# Altium schematic sheet 06.MCU_PD.SchDoc
size 297 x 209 mm
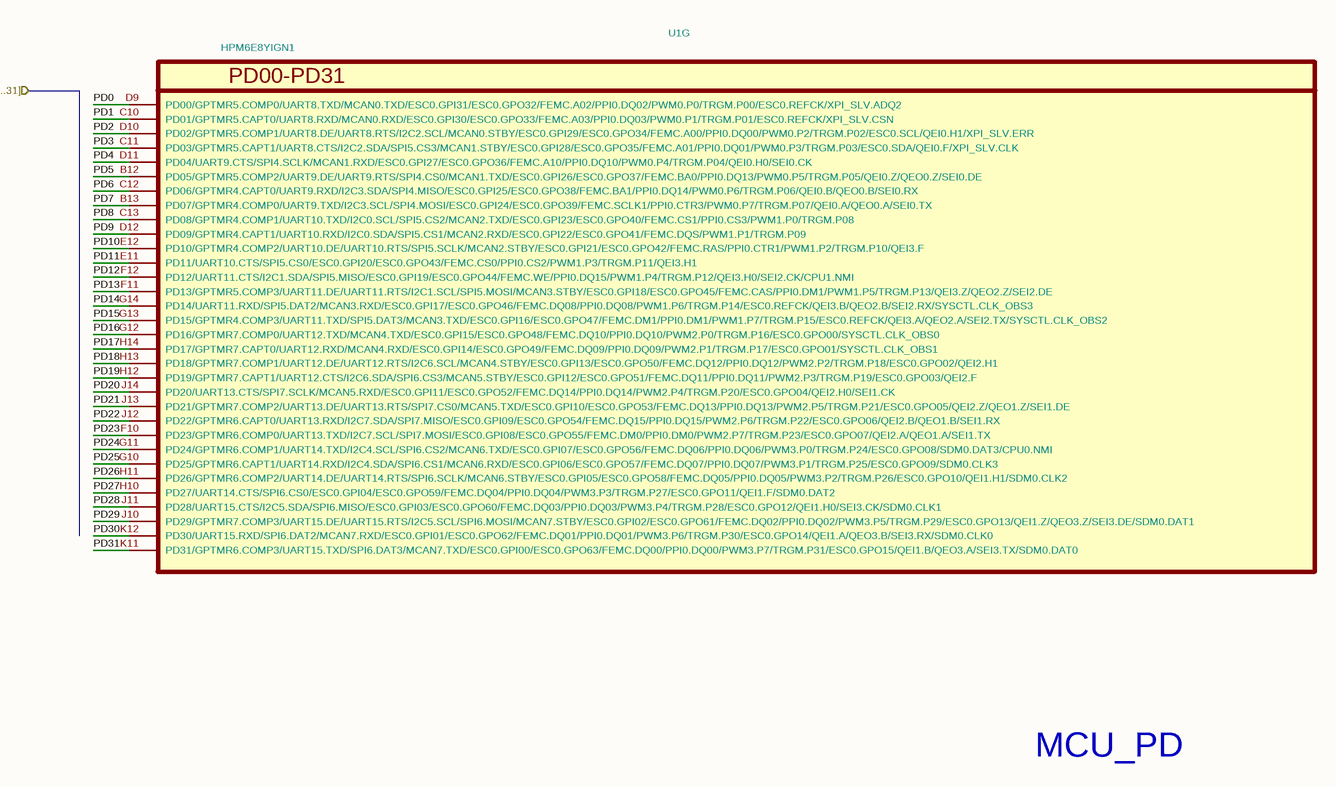
[diagram p0: 06.MCU_PD.SchDoc]

## Parts
U1  HPM6E8YIGN1  [BGA-196_14x14_12.0x12.0mm_P0.8mm]  (part G of 10)

## Ports
PD[0..31] (in)

## Nets
PD0: U1.D9(PD00/GPTMR5.COMP0/UART8.TXD/MCAN0.TXD/ESC0.GPI31/ESC0.GPO32/FEMC.A02/PPI0.DQ02/PWM0.P0/TRGM.P00/ESC0.REFCK/XPI_SLV.ADQ2)
PD1: U1.C10(PD01/GPTMR5.CAPT0/UART8.RXD/MCAN0.RXD/ESC0.GPI30/ESC0.GPO33/FEMC.A03/PPI0.DQ03/PWM0.P1/TRGM.P01/ESC0.REFCK/XPI_SLV.CSN)
PD2: U1.D10(PD02/GPTMR5.COMP1/UART8.DE/UART8.RTS/I2C2.SCL/MCAN0.STBY/ESC0.GPI29/ESC0.GPO34/FEMC.A00/PPI0.DQ00/PWM0.P2/TRGM.P02/ESC0.SCL/QEI0.H1/XPI_SLV.ERR)
PD3: U1.C11(PD03/GPTMR5.CAPT1/UART8.CTS/I2C2.SDA/SPI5.CS3/MCAN1.STBY/ESC0.GPI28/ESC0.GPO35/FEMC.A01/PPI0.DQ01/PWM0.P3/TRGM.P03/ESC0.SDA/QEI0.F/XPI_SLV.CLK)
PD4: U1.D11(PD04/UART9.CTS/SPI4.SCLK/MCAN1.RXD/ESC0.GPI27/ESC0.GPO36/FEMC.A10/PPI0.DQ10/PWM0.P4/TRGM.P04/QEI0.H0/SEI0.CK)
PD5: U1.B12(PD05/GPTMR5.COMP2/UART9.DE/UART9.RTS/SPI4.CS0/MCAN1.TXD/ESC0.GPI26/ESC0.GPO37/FEMC.BA0/PPI0.DQ13/PWM0.P5/TRGM.P05/QEI0.Z/QEO0.Z/SEI0.DE)
PD6: U1.C12(PD06/GPTMR4.CAPT0/UART9.RXD/I2C3.SDA/SPI4.MISO/ESC0.GPI25/ESC0.GPO38/FEMC.BA1/PPI0.DQ14/PWM0.P6/TRGM.P06/QEI0.B/QEO0.B/SEI0.RX)
PD7: U1.B13(PD07/GPTMR4.COMP0/UART9.TXD/I2C3.SCL/SPI4.MOSI/ESC0.GPI24/ESC0.GPO39/FEMC.SCLK1/PPI0.CTR3/PWM0.P7/TRGM.P07/QEI0.A/QEO0.A/SEI0.TX)
PD8: U1.C13(PD08/GPTMR4.COMP1/UART10.TXD/I2C0.SCL/SPI5.CS2/MCAN2.TXD/ESC0.GPI23/ESC0.GPO40/FEMC.CS1/PPI0.CS3/PWM1.P0/TRGM.P08)
PD9: U1.D12(PD09/GPTMR4.CAPT1/UART10.RXD/I2C0.SDA/SPI5.CS1/MCAN2.RXD/ESC0.GPI22/ESC0.GPO41/FEMC.DQS/PWM1.P1/TRGM.P09)
PD10: U1.E12(PD10/GPTMR4.COMP2/UART10.DE/UART10.RTS/SPI5.SCLK/MCAN2.STBY/ESC0.GPI21/ESC0.GPO42/FEMC.RAS/PPI0.CTR1/PWM1.P2/TRGM.P10/QEI3.F)
PD11: U1.E11(PD11/UART10.CTS/SPI5.CS0/ESC0.GPI20/ESC0.GPO43/FEMC.CS0/PPI0.CS2/PWM1.P3/TRGM.P11/QEI3.H1)
PD12: U1.F12(PD12/UART11.CTS/I2C1.SDA/SPI5.MISO/ESC0.GPI19/ESC0.GPO44/FEMC.WE/PPI0.DQ15/PWM1.P4/TRGM.P12/QEI3.H0/SEI2.CK/CPU1.NMI)
PD13: U1.F11(PD13/GPTMR5.COMP3/UART11.DE/UART11.RTS/I2C1.SCL/SPI5.MOSI/MCAN3.STBY/ESC0.GPI18/ESC0.GPO45/FEMC.CAS/PPI0.DM1/PWM1.P5/TRGM.P13/QEI3.Z/QEO2.Z/SEI2.DE)
PD14: U1.G14(PD14/UART11.RXD/SPI5.DAT2/MCAN3.RXD/ESC0.GPI17/ESC0.GPO46/FEMC.DQ08/PPI0.DQ08/PWM1.P6/TRGM.P14/ESC0.REFCK/QEI3.B/QEO2.B/SEI2.RX/SYSCTL.CLK_OBS3)
PD15: U1.G13(PD15/GPTMR4.COMP3/UART11.TXD/SPI5.DAT3/MCAN3.TXD/ESC0.GPI16/ESC0.GPO47/FEMC.DM1/PPI0.DM1/PWM1.P7/TRGM.P15/ESC0.REFCK/QEI3.A/QEO2.A/SEI2.TX/SYSCTL.CLK_OBS2)
PD16: U1.G12(PD16/GPTMR7.COMP0/UART12.TXD/MCAN4.TXD/ESC0.GPI15/ESC0.GPO48/FEMC.DQ10/PPI0.DQ10/PWM2.P0/TRGM.P16/ESC0.GPO00/SYSCTL.CLK_OBS0)
PD17: U1.H14(PD17/GPTMR7.CAPT0/UART12.RXD/MCAN4.RXD/ESC0.GPI14/ESC0.GPO49/FEMC.DQ09/PPI0.DQ09/PWM2.P1/TRGM.P17/ESC0.GPO01/SYSCTL.CLK_OBS1)
PD18: U1.H13(PD18/GPTMR7.COMP1/UART12.DE/UART12.RTS/I2C6.SCL/MCAN4.STBY/ESC0.GPI13/ESC0.GPO50/FEMC.DQ12/PPI0.DQ12/PWM2.P2/TRGM.P18/ESC0.GPO02/QEI2.H1)
PD19: U1.H12(PD19/GPTMR7.CAPT1/UART12.CTS/I2C6.SDA/SPI6.CS3/MCAN5.STBY/ESC0.GPI12/ESC0.GPO51/FEMC.DQ11/PPI0.DQ11/PWM2.P3/TRGM.P19/ESC0.GPO03/QEI2.F)
PD20: U1.J14(PD20/UART13.CTS/SPI7.SCLK/MCAN5.RXD/ESC0.GPI11/ESC0.GPO52/FEMC.DQ14/PPI0.DQ14/PWM2.P4/TRGM.P20/ESC0.GPO04/QEI2.H0/SEI1.CK)
PD21: U1.J13(PD21/GPTMR7.COMP2/UART13.DE/UART13.RTS/SPI7.CS0/MCAN5.TXD/ESC0.GPI10/ESC0.GPO53/FEMC.DQ13/PPI0.DQ13/PWM2.P5/TRGM.P21/ESC0.GPO05/QEI2.Z/QEO1.Z/SEI1.DE)
PD22: U1.J12(PD22/GPTMR6.CAPT0/UART13.RXD/I2C7.SDA/SPI7.MISO/ESC0.GPI09/ESC0.GPO54/FEMC.DQ15/PPI0.DQ15/PWM2.P6/TRGM.P22/ESC0.GPO06/QEI2.B/QEO1.B/SEI1.RX)
PD23: U1.F10(PD23/GPTMR6.COMP0/UART13.TXD/I2C7.SCL/SPI7.MOSI/ESC0.GPI08/ESC0.GPO55/FEMC.DM0/PPI0.DM0/PWM2.P7/TRGM.P23/ESC0.GPO07/QEI2.A/QEO1.A/SEI1.TX)
PD24: U1.G11(PD24/GPTMR6.COMP1/UART14.TXD/I2C4.SCL/SPI6.CS2/MCAN6.TXD/ESC0.GPI07/ESC0.GPO56/FEMC.DQ06/PPI0.DQ06/PWM3.P0/TRGM.P24/ESC0.GPO08/SDM0.DAT3/CPU0.NMI)
PD25: U1.G10(PD25/GPTMR6.CAPT1/UART14.RXD/I2C4.SDA/SPI6.CS1/MCAN6.RXD/ESC0.GPI06/ESC0.GPO57/FEMC.DQ07/PPI0.DQ07/PWM3.P1/TRGM.P25/ESC0.GPO09/SDM0.CLK3)
PD26: U1.H11(PD26/GPTMR6.COMP2/UART14.DE/UART14.RTS/SPI6.SCLK/MCAN6.STBY/ESC0.GPI05/ESC0.GPO58/FEMC.DQ05/PPI0.DQ05/PWM3.P2/TRGM.P26/ESC0.GPO10/QEI1.H1/SDM0.CLK2)
PD27: U1.H10(PD27/UART14.CTS/SPI6.CS0/ESC0.GPI04/ESC0.GPO59/FEMC.DQ04/PPI0.DQ04/PWM3.P3/TRGM.P27/ESC0.GPO11/QEI1.F/SDM0.DAT2)
PD28: U1.J11(PD28/UART15.CTS/I2C5.SDA/SPI6.MISO/ESC0.GPI03/ESC0.GPO60/FEMC.DQ03/PPI0.DQ03/PWM3.P4/TRGM.P28/ESC0.GPO12/QEI1.H0/SEI3.CK/SDM0.CLK1)
PD29: U1.J10(PD29/GPTMR7.COMP3/UART15.DE/UART15.RTS/I2C5.SCL/SPI6.MOSI/MCAN7.STBY/ESC0.GPI02/ESC0.GPO61/FEMC.DQ02/PPI0.DQ02/PWM3.P5/TRGM.P29/ESC0.GPO13/QEI1.Z/QEO3.Z/SEI3.DE/SDM0.DAT1)
PD30: U1.K12(PD30/UART15.RXD/SPI6.DAT2/MCAN7.RXD/ESC0.GPI01/ESC0.GPO62/FEMC.DQ01/PPI0.DQ01/PWM3.P6/TRGM.P30/ESC0.GPO14/QEI1.A/QEO3.B/SEI3.RX/SDM0.CLK0)
PD31: U1.K11(PD31/GPTMR6.COMP3/UART15.TXD/SPI6.DAT3/MCAN7.TXD/ESC0.GPI00/ESC0.GPO63/FEMC.DQ00/PPI0.DQ00/PWM3.P7/TRGM.P31/ESC0.GPO15/QEI1.B/QEO3.A/SEI3.TX/SDM0.DAT0)

## Notes on the sheet
- MCU_PD
- 1
- 2
- 3
- 4
- 5
- 6
- A
- B
- C
- D
- Title: HPM6E8Y_RbMotor_ECAT
- File: 06.MCU_PD.kicad_sch
- Sheet: /
- KiCad E.D.A.  kicad (5.1.4)-1
- Size: A4
- Date:
- Rev: RevB+
- Id: 1/1
- (in symbol HPM6E8YIGN1, part G) PD00-PD31

## Library data of the parts
U1 = HPM6E8YIGN1: Value: HPM6E8YIGN1; Footprint: 00_HPM_Library:BGA-196_14x14_12.0x12.0mm_P0.8mm